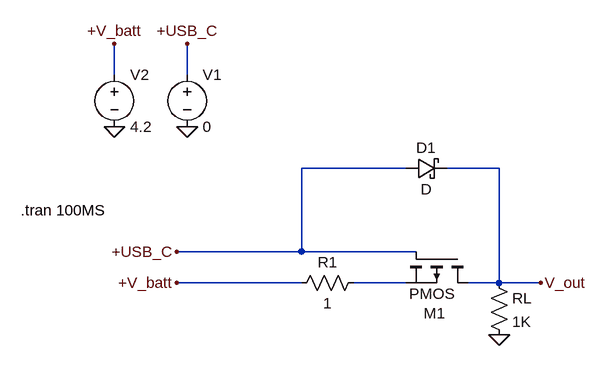
[diagram p0: schematic Draft2.asc]
Draft2.asc, the LTspice schematic file:
Version 4.1
SHEET 1 880 680
WIRE -16 -240 -16 -288
WIRE 96 -240 96 -288
WIRE 432 -96 272 -96
WIRE 576 -96 496 -96
WIRE 272 32 272 -96
WIRE 272 32 80 32
WIRE 448 32 272 32
WIRE 272 80 80 80
WIRE 432 80 352 80
WIRE 576 80 576 -96
WIRE 576 80 528 80
WIRE 640 80 576 80
FLAG 96 -288 +USB_C
FLAG 96 -160 0
FLAG -16 -160 0
FLAG -16 -288 +V_batt
FLAG 640 80 V_out
FLAG 80 80 +V_batt
FLAG 80 32 +USB_C
FLAG 576 160 0
SYMBOL voltage 96 -256 R0
WINDOW 123 0 0 Left 0
WINDOW 39 0 0 Left 0
SYMATTR InstName V1
SYMATTR Value 0
SYMBOL voltage -16 -256 R0
WINDOW 123 0 0 Left 0
WINDOW 39 0 0 Left 0
SYMATTR InstName V2
SYMATTR Value 4.2
SYMBOL pmos 528 32 R90
WINDOW 0 95 34 VRight 2
WINDOW 3 65 20 VRight 2
SYMATTR InstName M1
SYMBOL schottky 432 -80 R270
WINDOW 0 32 32 VTop 2
WINDOW 3 0 32 VBottom 2
SYMATTR InstName D1
SYMBOL res 368 64 R90
WINDOW 0 0 56 VBottom 2
WINDOW 3 32 56 VTop 2
SYMATTR InstName R1
SYMATTR Value 1
SYMBOL res 560 64 R0
SYMATTR InstName RL
SYMATTR Value 1K
TEXT -160 -32 Left 2 !.tran 100MS

The netlist it stands for:
* Draft2.asc
V1 +USB_C 0 0
V2 +V_batt 0 4.2
M1 V_out +USB_C N001 N001 PMOS
D1 +USB_C V_out D
R1 N001 +V_batt 1
RL V_out 0 1K
.model D D
.lib standard.dio
.model NMOS NMOS
.model PMOS PMOS
.lib standard.mos
.tran 100MS
.backanno
.end